# Altium schematic sheet gps.SchDoc
size A
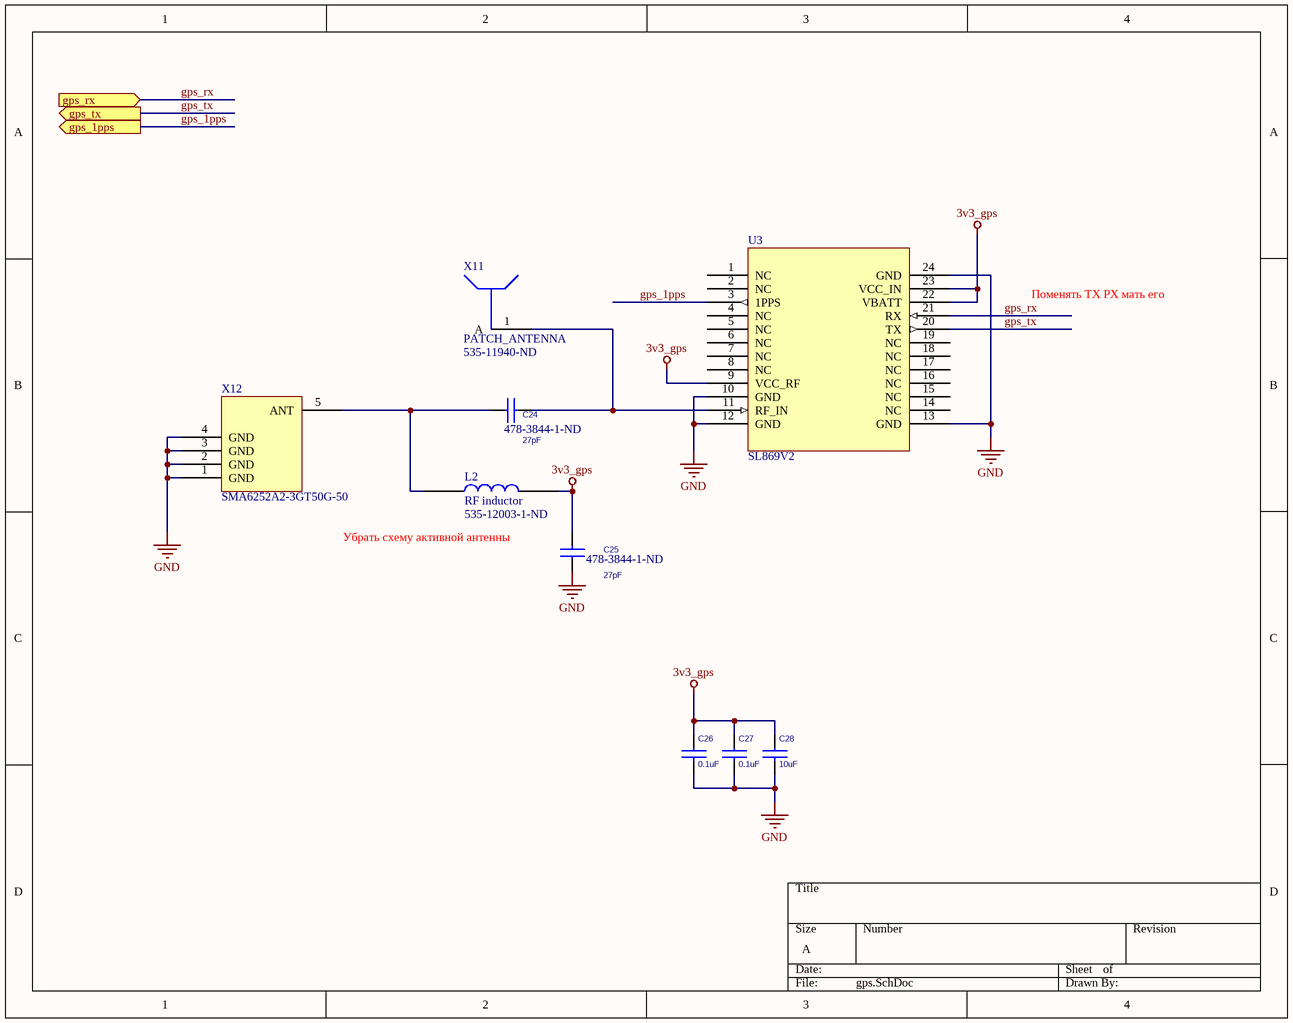
[diagram p0: gps.SchDoc]

## Parts
C24  27pF  Supplier Part Number 1: 478-3844-1-ND  [CAPC2012X09M]
C25  27pF  Supplier Part Number 1: 478-3844-1-ND  [CAPC2012X09M]
C26  0.1uF  [CAPC2012X09M]
C27  0.1uF  [CAPC2012X09M]
C28  10uF  [CAPC2012X09M]
L2  RF inductor  Supplier Part Number 1: 535-12003-1-ND  [DIOC2012X11N_RF]
U3  SL869V2  [SL869V2_FOOT]
X11  PATCH_ANTENNA  Supplier Part Number 1: 535-11940-ND  [PATCH_ANTENNA]
X12  SMA6252A2-3GT50G-50  [SMA6252A2-3GT50G-50]

## Ports
gps_1pps (out), gps_rx (in), gps_tx (out)

## Nets
3v3_gps: C25.2 C26.1 C27.1 C28.1 L2.2 U3.9(VCC_RF) U3.22(VBATT) U3.23(VCC_IN)
GND: C25.1 C26.2 C27.2 C28.2 U3.10(GND) U3.12(GND) U3.13(GND) U3.24(GND) X12.1(GND) X12.2(GND) X12.3(GND) X12.4(GND)
gps_1pps: U3.3(1PPS) ; port gps_1pps
gps_rx: U3.21(RX) ; port gps_rx
gps_tx: U3.20(TX) ; port gps_tx
NetC24_1: C24.1 L2.1 X12.5(ANT)
NetC24_2: C24.2 U3.11(RF_IN) X11.1(A)

Not connected (* = marked no-connect by the designer): U3 1(NC) 2(NC) 4(NC) 5(NC) 6(NC) 7(NC) 8(NC) 14(NC) 15(NC) 16(NC) 17(NC) 18(NC) 19(NC)

## Notes on the sheet
- Поменять ТХ РХ мать его
- Убрать схему активной антенны

## Library data of the parts
C24 C25 = CAP_SMD_27PF_5%: CAP CER 27PF 200V 5% NP0 0805; Value: 27pF; Supplier 1: Digi-Key
C26 C27 = CAP_SMD_0.1UF_10%: CAP CER 0.1UF 25V 10% X7R 0805; Value: 0.1uF; Supplier 1: Digi-Key; Supplier Part Number 1: 399-1168-6-ND
C28 = CAP_SMD_10UF_20%: CAP CER 10UF 16V 20% X5R 0805; Value: 10uF; Supplier 1: Digi-Key; Supplier Part Number 1: 399-8013-1-ND
L2 = RF_IND35.5nH: RF 35.5NH 1.5GHZ; value: 35.5nH; Supplier 1: Digi-Key
X12 = SMA_CONN: Supplier 1: Mouser; Supplier Part Number 1: 523-901-143-6RFX
X11 = PATCH_ANTENNA: Supplier 1: Digi-Key